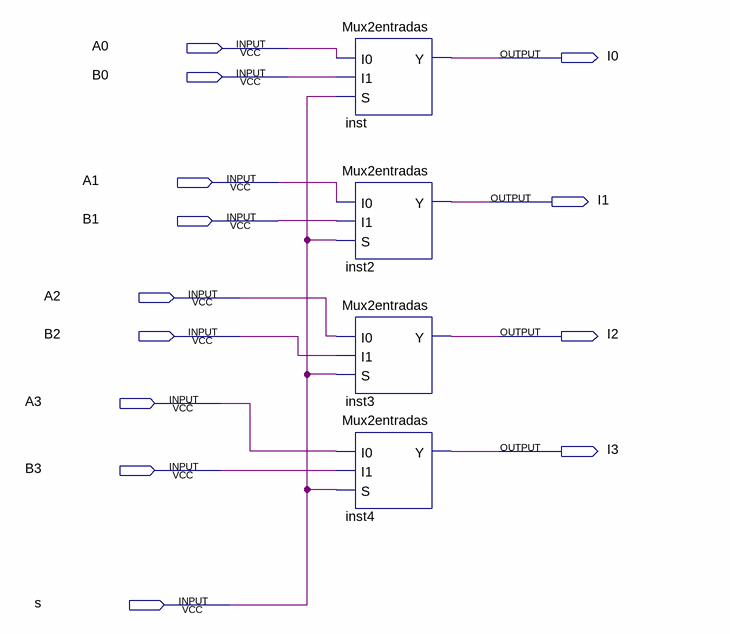
[diagram p0: schematic sheet]
// Quartus schematic Cuadruple2a1.bdf as structural Verilog: 4 symbols, 13 pins
module Cuadruple2a1 (
  input  A0,
  input  B0,
  input  A1,
  input  B1,
  input  A2,
  input  B2,
  input  A3,
  input  B3,
  input  s,
  output I0,
  output I1,
  output I2,
  output I3
);

  Mux2entradas inst (.I0(A0), .I1(B0), .S(s), .Y(I0));
  Mux2entradas inst2 (.I0(A1), .I1(B1), .S(s), .Y(I1));
  Mux2entradas inst3 (.I0(A2), .I1(B2), .S(s), .Y(I2));
  Mux2entradas inst4 (.I0(A3), .I1(B3), .S(s), .Y(I3));
endmodule
